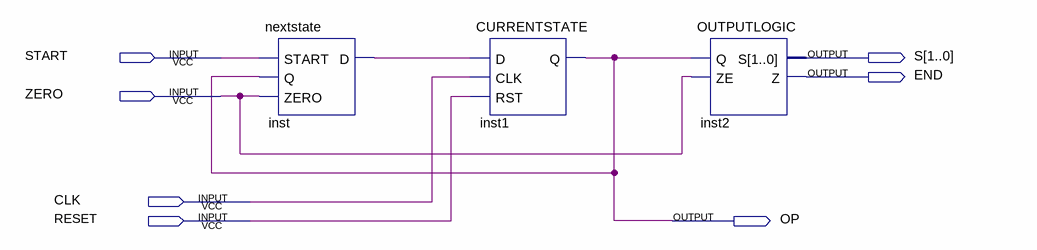
[diagram p0: schematic sheet]
// Quartus schematic Control.bdf as structural Verilog: 3 symbols, 7 pins
module Control (
  input  START,
  input  ZERO,
  input  CLK,
  input  RESET,
  output [1:0] S,
  output END,
  output OP
);

  wire inst_d;

  nextstate inst (.START(START), .Q(OP), .ZERO(ZERO), .D(inst_d));
  CURRENTSTATE inst1 (.D(inst_d), .CLK(CLK), .RST(RESET), .Q(OP));
  OUTPUTLOGIC inst2 (.Q(OP), .ZE(ZERO), .S(S), .Z(END));
endmodule
